# EAGLE schematic untitled (EAGLE 5.11)
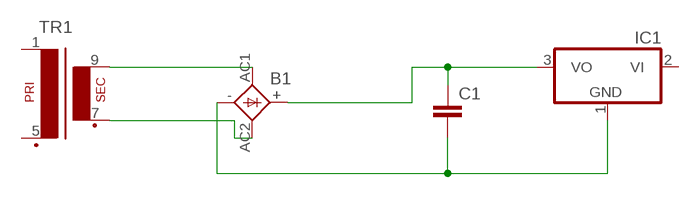
[diagram p0: schematic, sheet 1]

## Parts
B1  1KAB  [1KAB]
C1  C2,5-3  [C2.5-3]
IC1  7906T  [TO220H]
TR1  EI42-1B  [EI42-1B]

## Nets
N$1: B1.AC1 TR1.9(S4)
N$2: B1.AC2 TR1.7(S3)
N$3: B1.+ C1.1 IC1.3(VO)
N$4: B1.- C1.2 IC1.1(GND)
Unconnected: IC1.2(VI) TR1.1 TR1.5(P2)

## Library data of the parts
B1 = rectifier:1KAB: RECTIFIER grid 5,08 x 5,08 mm
C1 = capacitor-wima:C: CAPACITOR naming: grid - package width
IC1 = linear:79*: Negative VOLTAGE REGULATOR
TR1 = trafo:EI42-1B: TRANSFORMER 1 primary winding, 1 secondary winding, mounting holes ERA